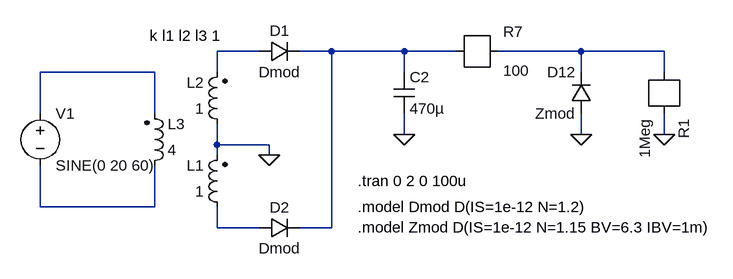
[diagram p0: schematic circuit_a_lt.asc]
circuit_a_lt.asc, the LTspice schematic file:
Version 4
SHEET 1 2116 1016
WIRE 368 -240 304 -240
WIRE 480 -240 432 -240
WIRE 592 -240 480 -240
WIRE 672 -240 592 -240
WIRE 864 -240 736 -240
WIRE 992 -240 864 -240
WIRE 208 -208 32 -208
WIRE 304 -208 304 -240
WIRE 592 -208 592 -240
WIRE 864 -208 864 -240
WIRE 992 -208 992 -240
WIRE 32 -144 32 -208
WIRE 208 -144 208 -208
WIRE 592 -112 592 -144
WIRE 864 -112 864 -144
WIRE 992 -112 992 -144
WIRE 304 -96 304 -128
WIRE 384 -96 304 -96
WIRE 304 -80 304 -96
WIRE 384 -80 384 -96
WIRE 32 0 32 -64
WIRE 208 0 208 -64
WIRE 208 0 32 0
WIRE 304 32 304 0
WIRE 368 32 304 32
WIRE 480 32 480 -240
WIRE 480 32 432 32
FLAG 592 -112 0
FLAG 864 -112 0
FLAG 384 -80 0
FLAG 992 -112 0
SYMBOL voltage 32 -160 R0
SYMATTR InstName V1
SYMATTR Value SINE(0 20 60)
SYMATTR SpiceLine Rser=1
SYMBOL cap 576 -208 R0
SYMATTR InstName C2
SYMATTR Value 470µ
SYMBOL r 672 -240 R0
SYMATTR InstName R7
SYMATTR Value 100
SYMBOL diode 880 -144 R180
WINDOW 0 24 64 Left 2
WINDOW 3 24 0 Left 2
SYMATTR InstName D12
SYMATTR Value Zmod
SYMBOL ind2 320 16 R180
WINDOW 0 36 80 Left 2
WINDOW 3 36 40 Left 2
SYMATTR InstName L1
SYMATTR Value 1
SYMATTR Type ind
SYMBOL ind2 320 -112 R180
WINDOW 0 36 80 Left 2
WINDOW 3 36 40 Left 2
SYMATTR InstName L2
SYMATTR Value 1
SYMATTR Type ind
SYMBOL ind2 192 -48 M180
WINDOW 0 36 80 Left 2
WINDOW 3 36 40 Left 2
SYMATTR InstName L3
SYMATTR Value 4
SYMATTR Type ind
SYMBOL diode 368 -224 R270
WINDOW 0 32 32 VTop 2
WINDOW 3 0 32 VBottom 2
SYMATTR InstName D1
SYMATTR Value Dmod
SYMBOL diode 368 48 R270
WINDOW 0 32 32 VTop 2
WINDOW 3 0 32 VBottom 2
SYMATTR InstName D2
SYMATTR Value Dmod
SYMBOL r 992 -208 R90
SYMATTR InstName R1
SYMATTR Value 1Meg
TEXT 520 -40 Left 2 !.tran 0 2 0 100u
TEXT 520 0 Left 2 !.model Dmod D(IS=1e-12 N=1.2)\n.model Zmod D(IS=1e-12 N=1.15 BV=6.3 IBV=1m)
TEXT 200 -264 Left 2 !k l1 l2 l3 1

The netlist it stands for:
* circuit_a_lt.asc
V1 N004 N005 SINE(0 20 60) Rser=1
C2 N002 0 470µ
R7 N003 N002 100
D12 0 N003 Zmod
L1 N006 0 1
L2 0 N001 1
L3 N005 N004 4
D1 N001 N002 Dmod
D2 N006 N002 Dmod
R1 0 N003 1Meg
.model D D
.lib standard.dio
.tran 0 2 0 100u
.model Dmod D(IS=1e-12 N=1.2)
.model Zmod D(IS=1e-12 N=1.15 BV=6.3 IBV=1m)
k l1 l2 l3 1
.backanno
.end